# EAGLE design MyoWare_LED_Shield (EAGLE 7.5.0)
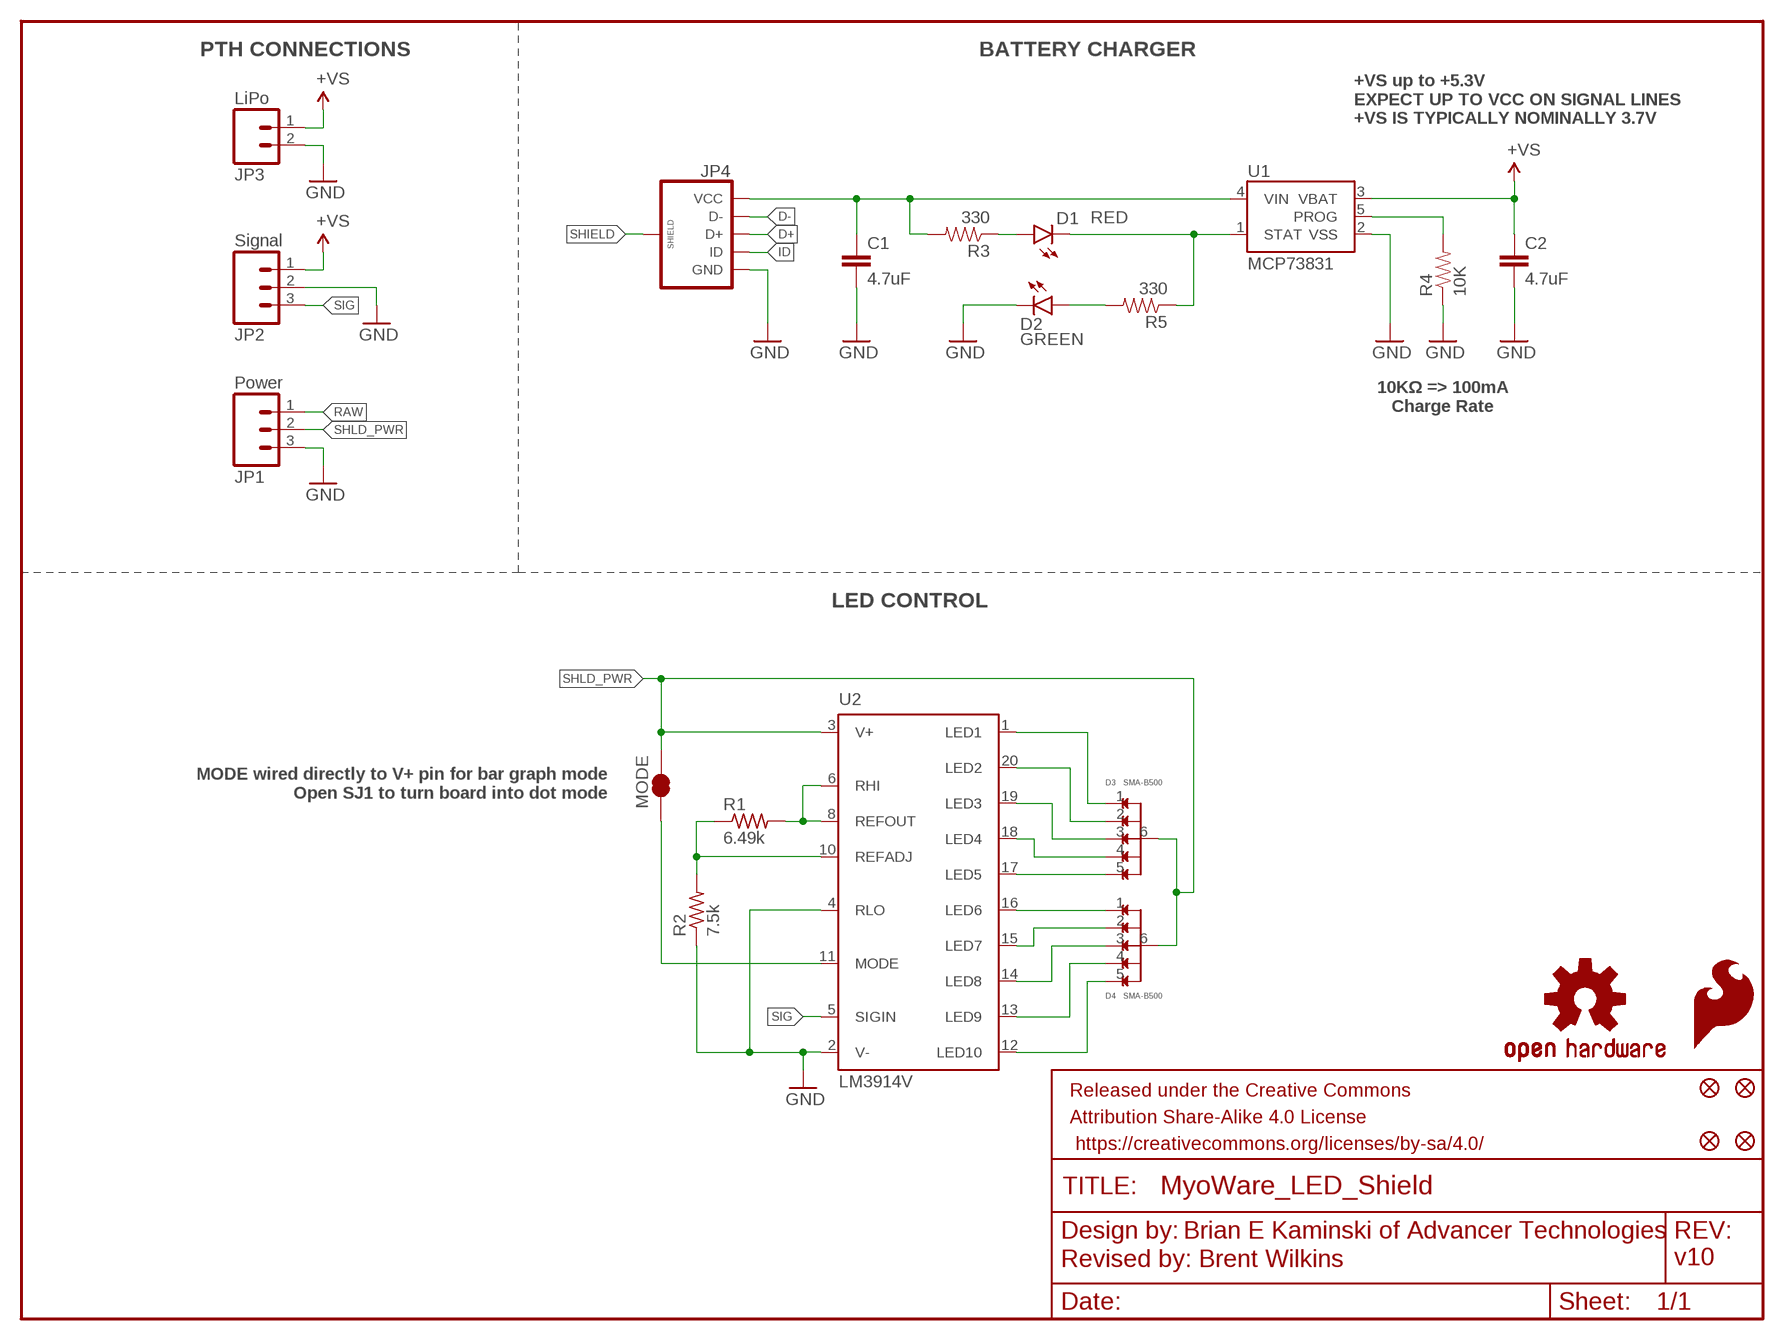
[diagram p0: schematic, sheet 1]

## Parts
C1  4.7uF  4.7UF-6.3V-10%(0603)0603  [0603-CAP]
C2  4.7uF  4.7UF-6.3V-10%(0603)0603  [0603-CAP]
D1  RED  LED-RED0603  [LED-0603]
D2  GREEN  LED-GREEN0603  [LED-0603]
D3  SMA-B500  [LED_BAR_SMD]
D4  SMA-B500  [LED_BAR_SMD]
FID1  FIDUCIAL1X2  [FIDUCIAL-1X2]
FID2  FIDUCIAL1X2  [FIDUCIAL-1X2]
FID3  FIDUCIAL1X2  [FIDUCIAL-1X2]
FID4  FIDUCIAL1X2  [FIDUCIAL-1X2]
FRAME1  FRAME-LETTER  [CREATIVE_COMMONS]
JP1  Power  M031X03_NO_SILK  [1X03_NO_SILK]
JP2  Signal  M031X03_NO_SILK  [1X03_NO_SILK]
JP3  LiPo  M021X02_NO_SILK  [1X02_NO_SILK]
JP4  USB_MICROB_PLUGCONN-11752  [USB-B-MICRO-SMD_V03]
LOGO1  SFE_LOGO_FLAME.1_INCH  [SFE_LOGO_FLAME_.1]
LOGO2  OSHW-LOGOS  [OSHW-LOGO-S]
MODE  JUMPER-PAD-2-NC_BY_TRACE  [PAD-JUMPER-2-NC_BY_TRACE_YES_SILK]
R1  6.49k  R-US_R0603  [R0603]
R2  7.5k  R-US_R0603  [R0603]
R3  330  330OHM1/10W1%(0603)  [0603-RES]
R4  10K  10KOHM-1/10W-1%(0603)0603  [0603-RES]
R5  330  330OHM1/10W1%(0603)  [0603-RES]
U1  MCP73831  [SOT23-5]
U2  LM3914V  [PLCC20S]

## Nets
+VS: C2.1 JP2.1 JP3.1 U1.3(VBAT)
D+: JP4.D+
D-: JP4.D-
GND: C1.2 C2.2 D2.C JP1.3 JP2.2 JP3.2 JP4.GND R2.1 R4.1 U1.2(VSS) U2.2(V-) U2.4(RLO)
ID: JP4.ID
N$1: D3.1 U2.1(LED1)
N$2: D3.2 U2.20(LED2)
N$3: D3.5 U2.17(LED5)
N$4: D3.3 U2.19(LED3)
N$5: D4.1 U2.16(LED6)
N$6: MODE.1 U2.11(MODE)
N$8: D3.4 U2.18(LED4)
N$9: D2.A R5.2
N$10: D1.A R3.1
N$11: D4.2 U2.15(LED7)
N$12: D4.3 U2.14(LED8)
N$13: D4.4 U2.13(LED9)
N$14: D4.5 U2.12(LED10)
N$15: D1.C R5.1 U1.1(STAT)
N$17: R4.2 U1.5(PROG)
N$19: R1.1 R2.2 U2.10(REFADJ)
N$20: R1.2 U2.6(RHI) U2.8(REFOUT)
RAW: JP1.1
SHIELD: JP4.SHIELD1(SHIELD) JP4.SHIELD2(SHIELD) JP4.SHIELD3(SHIELD)
SHLD_PWR: D3.6 D4.6 JP1.2 MODE.2 U2.3(V+)
SIG: JP2.3 U2.5(SIGIN)
VBUS: C1.1 JP4.VBUS(VCC) R3.2 U1.4(VIN)

## Notes on the sheet
- PTH CONNECTIONS | BATTERY CHARGER
- +VS up to +5.3V
  EXPECT UP TO VCC ON SIGNAL LINES
  +VS IS TYPICALLY NOMINALLY 3.7V
- 10KΩ => 100mA
  Charge Rate
- LED CONTROL
- MODE wired directly to V+ pin for bar graph mode
  Open SJ1 to turn board into dot mode
- Brian E Kaminski of Advancer Technologies
- Revised by: Brent Wilkins | v10

## Library data of the parts
C1 C2 = SparkFun-Capacitors:4.7UF-6.3V-10%(0603): CAP-08280; PROD_ID: CAP-08280
D1 = SparkFun-LED:LED-RED: Assorted Red LEDs LilyPad 1206- DIO-09912 1206- DIO-00809 0603- DIO-00819 "SMART" means more efficient and expensive; PROD_ID: DIO-00819
D2 = SparkFun-LED:LED-GREEN: Various green LEDs Green LEDs used in SFE Production 0603- DIO-00821 LARGE- DIO-00862 LILYPAD- DIO-09910; PROD_ID: DIO-00821
D3 D4 = Testing:SMA-B500; PROD_ID: DIO-13127
FID1-FID4 = SparkFun-Aesthetics:FIDUCIAL: Fiducial Alignment Points Various fiducial points for machine vision alignment.
FRAME1 = SparkFun-Aesthetics:FRAME-LETTER: Schematic Frame Standard 8.5x11 US Letter frame
JP1 JP2 = SparkFun-Connectors:M03: Header 3 Standard 3-pin 0.1" header. Use with straight break away headers (SKU : PRT-00116), right angle break away headers (PRT-00553), swiss pins (PRT-00743), machine pins (PRT-00117), and female headers (PRT-00115). Molex polarized connector foot print use with SKU : PRT-08232 with associated crimp pins and housings.
JP3 = SparkFun-Connectors:M02: Standard 2-pin 0.1" header. Use with - straight break away headers ( PRT-00116) - right angle break away headers (PRT-00553) - swiss pins (PRT-00743) - machine pins (PRT-00117) - female headers (PRT-00115) Molex polarized connector foot print use with: PRT-08233 with associated crimp pins and housings. 2.54_SCREWTERM for use with PRT-10571. 3.5mm Screw Terminal footprints for PRT-08084 5mm Screw Terminal footprints for use with PRT-08432
JP4 = SparkFun-Connectors:USB_MICROB_PLUG: USB Micro-B connectors Some male, some female. Watch your step!; PROD_ID: CONN-11752
LOGO1 = SparkFun-Aesthetics:SFE_LOGO_FLAME: SFE Logo, flame only This is the SparkFun flame logo. The logo on the schematic will always be the same size; the package variant is the height of the flame. Default layer for the logo on the board is tSilk.
LOGO2 = SparkFun-Aesthetics:OSHW-LOGO: Open Source Hardware Logo This logo indicates the piece of hardware it is found on incorporates a OSHW license and/or adheres to the definition of open source hardware found here: http://freedomdefined.org/OSHW
MODE = SparkFun-Passives:JUMPER-PAD-2-NC_BY_TRACE
R1 = resistor:R-US_: RESISTOR, American symbol; PROD_ID: RES-13202
R2 = resistor:R-US_: RESISTOR, American symbol; PROD_ID: RES-13203
R3 R5 = SparkFun-Resistors:330OHM1/10W1%(0603): RES-00818; PROD_ID: RES-00818
R4 = SparkFun-Resistors:10KOHM-1/10W-1%(0603): RES-00824; PROD_ID: RES-00824
U1 = SparkFun-PowerIC:MCP73831: Miniature single cell, fully integrated Li-Ion, Li-polymer charge management controller http://ww1.microchip.com/downloads/en/DeviceDoc/20001984g.pdf IC-09995; PROD_ID: IC-09995
U2 = Testing:LM391: Dot/Bar Display Driver Source: Data sheet LM3915 <http://www.national.com/ds/LM/LM3915.pdf> Data sheet LM3914 <http://www.national.com/ds/LM/LM3914.pdf>; PROD_ID: IC-13110

## Board
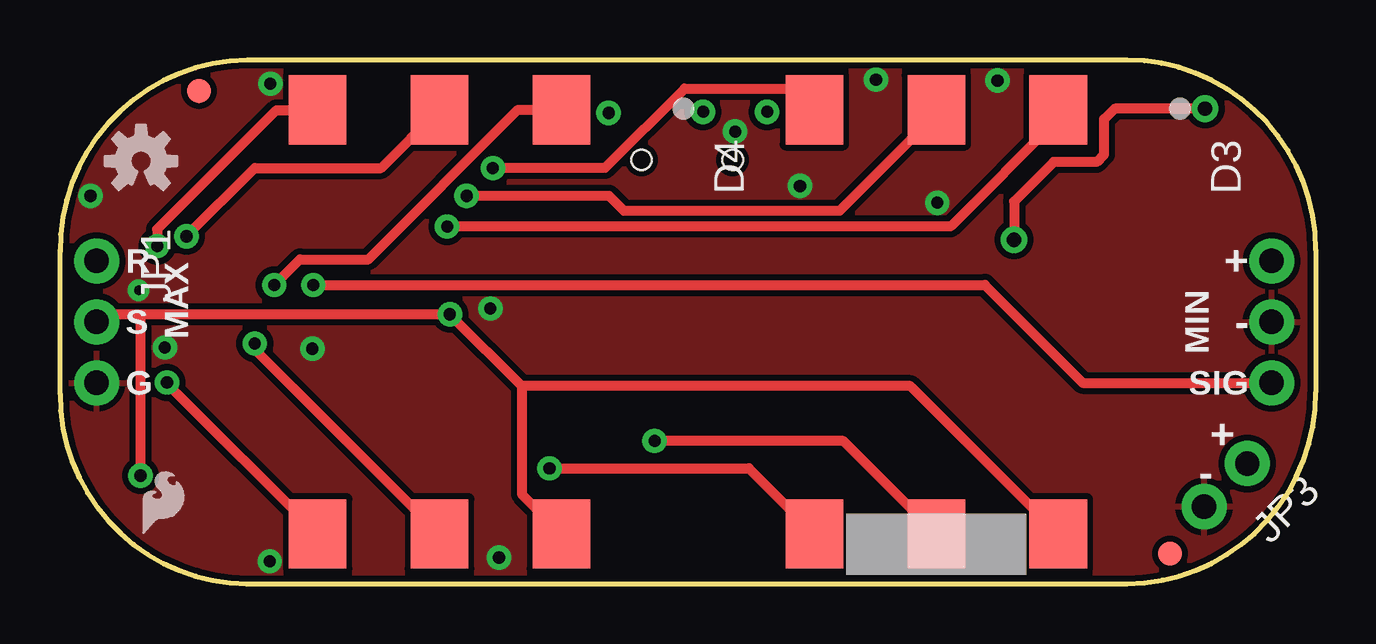
[diagram p1: board, top side]
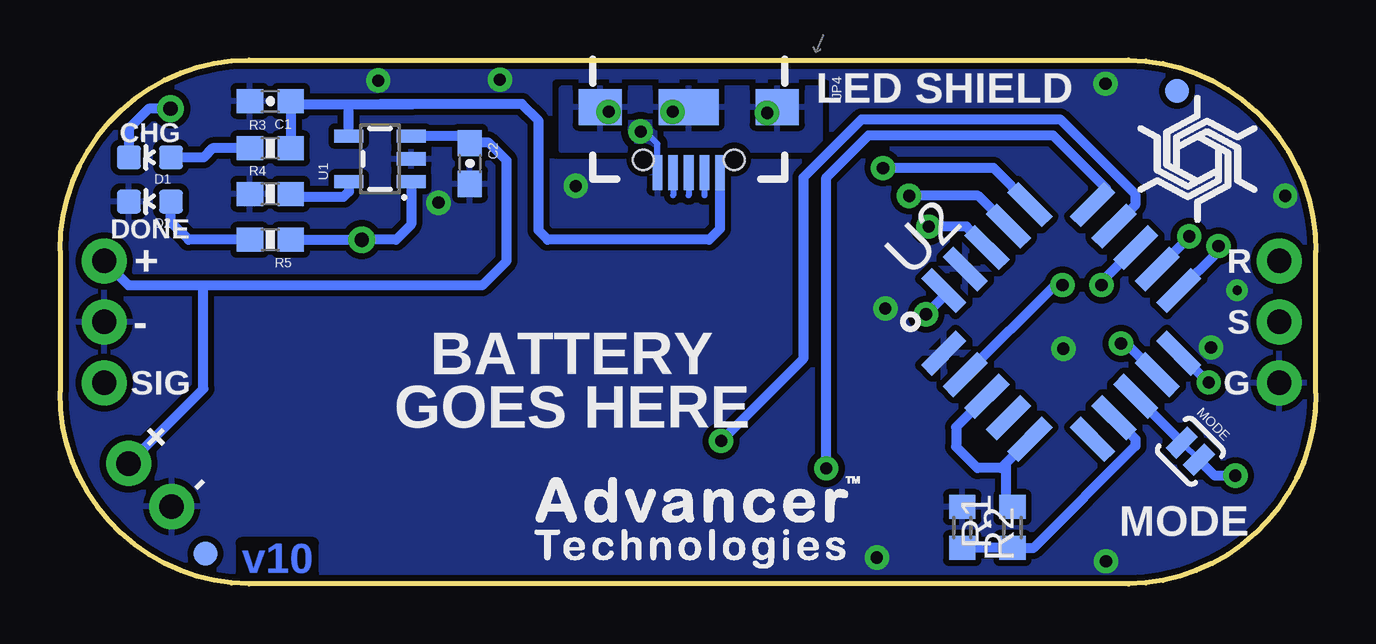
[diagram p2: board, bottom side, seen from below]

Size 52.32 x 21.84 mm. Coordinates in mm from the lower left corner, seen from the top.
Outline: 7.78,0 7.81,0
Outline: 7.81,0 44.45,0 arc90 52.32,8 52.32,13.91 arc90 44.45,21.84 7.81,21.84 arc90 0,13.84
Outline: 0,13.84 0,7.94 arc90 7.81,0
Outline: 0,13.84 0,13.91
Copper layers (1*16): Top 0.035mm / dielectric 1.5mm / Bottom 0.035mm
Design rules "SparkFun-2-layer-STANDARD": minimum track width 10mil, minimum drill 20mil, track to track 10mil, track to pad 8mil, pad to pad 8mil, via to via 10mil, smd to smd 8mil, copper to edge 8mil, drill to drill 8mil, minimum pad ring 10mil, minimum via ring 10mil, stop-mask expansion 4mil, vias tented up to drill 20mil, thermal gap 10mil

### Footprints (pad centres in the part's own frame; a part is rotated, then mirrored left to right if it is on the bottom)
0603-CAP = smd 1.1 x 1: 1 -0.85,0; 2 0.85,0
LED-0603 = smd 1 x 1: A 0,-0.877; C 0,0.877
LED_BAR_SMD = smd 2.4 x 2.88: 1 -5.08,-8.84; 2 0,-8.84; 3 5.08,-8.84; 4 5.08,8.84; 5 0,8.84; 6 -5.08,8.84
FIDUCIAL-1X2 = smd 1 x 1: 1 0,0
1X03_NO_SILK = drill 1.016 pad 1.88: 1 0,0; 2 2.54,0; 3 5.08,0
1X02_NO_SILK = drill 1.016 pad 1.88: 1 0,0; 2 2.54,0
USB-B-MICRO-SMD_V03 = smd 1.45 x 0.4: D+ 2.725,0; D- 2.725,0.65; GND 2.725,-1.3; ID 2.725,-0.65; VBUS 2.725,1.3 | smd 1.5 x 1.8: SHIELD1 0,3.685; SHIELD2 0,-3.685 | smd 1.5 x 2.5: SHIELD3 0,0 | hole 0.85: 2.2,1.9; 2.2,-1.9
PAD-JUMPER-2-NC_BY_TRACE_YES_SILK = smd 0.635 x 1.27: 1 -0.508,0; 2 0.508,0
R0603 = smd 1 x 1.1: 1 -0.85,0; 2 0.85,0
0603-RES = smd 1.1 x 1: 1 -0.85,0; 2 0.85,0
SOT23-5 = smd 0.55 x 1.2: 1 -0.95,-1.3; 2 0,-1.3; 3 0.95,-1.3; 4 0.95,1.3; 5 -0.95,1.3
PLCC20S = smd 0.63 x 2.035: 1 0,4.383; 2 -1.27,4.383; 3 -2.54,4.383; 9 -2.54,-4.383; 10 -1.27,-4.383; 11 0,-4.383; 12 1.27,-4.383; 13 2.54,-4.383; 19 2.54,4.383; 20 1.27,4.383 | smd 2.035 x 0.63: 4 -4.383,2.54; 5 -4.383,1.27; 6 -4.383,0; 7 -4.383,-1.27; 8 -4.383,-2.54; 14 4.383,-2.54; 15 4.383,-1.27; 16 4.383,0; 17 4.383,1.27; 18 4.383,2.54

### Placement (x,y rotation side)
C1  43.56,20.13 180 bottom
C2  35.24,17.53 270 bottom
D1  48.58,17.78 90 bottom
D2  48.58,15.94 90 bottom
D3  36.51,10.92 180 top
D4  15.81,10.92 180 top
FID1  5.79,20.55 0 bottom
FID2  46.25,1.27 0 bottom
FID3  46.25,1.27 0 top
FID4  5.79,20.55 0 top
FRAME1  -12.19,-15.49 0 top  (outside the outline)
JP1  1.52,13.46 270 top
JP2  50.48,13.46 270 top
JP3  49.47,5.02 225 top
JP4  26.13,19.88 270 bottom
LOGO1  3.15,1.75 0 top
LOGO2  3.38,17.63 0 top
MODE  5.23,5.53 315 bottom
R1  12.64,2.35 90 bottom
R2  14.73,2.35 270 bottom
R3  43.56,18.16 0 bottom
R4  43.56,16.26 0 bottom
R5  43.56,14.35 180 bottom
U1  38.99,17.72 90 bottom
U2  10.6,10.92 45 bottom
U$6  [ADVANCER_LOGO]  26.13,2.35 0 bottom
U$9  [SPIRAL_LOGO_60%]  4.89,17.72 0 bottom

### Tracks (layer width: path | path; a pad name or v marks a point on that pad's centre or on a via)
+VS
  Bottom 0.406: 35.24,18.41 35.24,18.67 U1.3 | 35.24,18.41 C2.1 | 46.35,12.45 34.73,12.45 33.72,13.46 33.72,17.65 34.48,18.41 35.24,18.41 | JP3.1 46.35,8.13 46.35,12.45 | 46.35,12.45 49.47,12.45 JP2.1
D+
  Bottom 0.254: JP4.D+ 26.13,16.19
D-
  Bottom 0.254: JP4.D- 25.48,16.19
GND  (via drill 0.38, 0.51)
  Bottom 0.254: 27.75,18.67 27.43,18.35 27.43,17.45 JP4.GND
  other vias: 1.27,16.18 30.84,16.59 18.29,1.09 10.52,9.8 4.37,9.86 3.28,12.24 8.74,0.94 17.93,11.48 8.76,20.85 34,21.02 39.06,20.98 36.55,15.89 28.13,18.86
  pour Bottom (isolate 0.254, rank 3): 0,0 52.32,0 52.32,21.84 0,21.84
  pour Top (isolate 0.254): 0,21.84 52.32,21.84 52.32,0 0,0
ID
  Bottom 0.254: JP4.ID 26.78,16.19
N$1  (via drill 0.51)
  Top 0.406: v16.13,14.9 37.11,14.9 41.58,19.37 41.58,19.75 D3.1
  Bottom 0.406: v16.13,14.9 14.55,14.9 13.7,14.05 U2.1
N$2  (via drill 0.51)
  Top 0.406: v16.94,16.18 22.87,16.18 23.5,15.56 32.49,15.56 36.3,19.37 36.3,19.55 D3.2
  Bottom 0.406: U2.20 14.07,16.18 v16.94,16.18
N$3  (via drill 0.51)
  Top 0.406: v24.78,5.96 32.64,5.96 D3.5
  Bottom 0.406: v24.78,5.96 21.34,9.4 21.34,16.95 18.92,19.37 10.65,19.37 7.53,16.25 7.53,15.79 U2.17
N$4  (via drill 0.51)
  Top 0.406: v18.03,17.34 22.71,17.34 26.02,20.65 30.63,20.65 31.43,19.85 D3.3 31.23,19.96
  Bottom 0.406: U2.19 13.43,17.34 v18.03,17.34
N$5  (via drill 0.51)
  Top 0.406: v8.93,12.46 9.99,13.53 12.84,13.53 19.08,19.76 D4.1
  Bottom 0.406: U2.16 8.93,12.6 v8.93,12.46
N$6
  Bottom 0.406: U2.11 MODE.1
N$8  (via drill 0.51)
  Top 0.406: v20.4,4.81 28.7,4.81 D3.4
  Bottom 0.406: 8.83,16.45 8.83,16.29 U2.18 9.3,15.92 8.74,16.48 10.95,18.69 18.64,18.69 20.4,16.94 v20.4,4.81
N$9
  Bottom 0.406: R5.2 46.97,14.35 47.7,15.09 D2.A
N$10
  Bottom 0.406: R3.1 45.96,18.16 46.34,17.78 D1.A
N$11  (via drill 0.51)
  Top 0.406: D4.2 13.38,17.34 8.12,17.34 v5.27,14.49
  Bottom 0.406: U2.15 5.27,14.46 v5.27,14.49
N$12  (via drill 0.51)
  Top 0.406: D4.3 10.72,19.75 9.02,19.75 4.05,14.78 v4.05,14.08
  Bottom 0.406: U2.14 4.05,13.88 v4.05,14.08
N$13  (via drill 0.51)
  Top 0.406: v4.46,8.39 4.46,8.36 D4.4
  Bottom 0.406: U2.13 4.49,8.39 v4.46,8.39
N$14  (via drill 0.51)
  Top 0.406: v8.12,10.02 8.12,9.78 D4.5
  Bottom 0.406: U2.12 7.91,10.02 v8.12,10.02
N$15  (via drill 0.6)
  Top 0.406: v47.72,19.81 43.94,19.81 43.51,19.38 43.51,17.91 43.19,17.59 41.4,17.59 39.75,15.94 v39.75,14.35
  Bottom 0.406: U1.1 37.69,14.99 38.32,14.35 v39.75,14.35 R5.1 | v47.72,19.81 48.63,19.81 49.45,18.99 D1.C
N$17
  Bottom 0.406: U1.5 40.29,16.35 40.51,16.13 42.58,16.13 R4.2
N$19
  Bottom 0.406: R2.2 R1.1 12.62,1.49 11.77,1.49 7.52,5.74 7.52,6.04 U2.10
N$20
  Bottom 0.406: R1.2 12.89,3.2 12.89,5.04 U2.8 13.11,4.83 14.1,4.83 14.99,5.71 14.99,6.54 U2.6
SHIELD  (via drill 0.51)
  Bottom 0.254: JP4.SHIELD3 26.13,19.68 v26.8,19.68 | v29.46,19.68 29.46,19.88 JP4.SHIELD2
  other vias: 22.86,19.64
  pour Bottom (isolate 0.305): 20.64,20.64 31.43,20.64 31.43,18.1 20.64,18.1
SHLD_PWR  (via drill 0.51)
  Top 0.406: 3.35,11.24 v16.24,11.24 19.24,8.24 | 3.35,11.24 1.75,11.24 1.75,11.15 JP1.2 | 3.35,11.24 v3.35,4.51 | 19.24,8.24 35.43,8.24 D3.6 | 19.24,8.24 19.24,3.73 D4.6
  Bottom 0.406: v16.24,11.24 15.43,12.05 15.43,12.16 U2.3 | v3.35,4.51 4.2,4.51 MODE.2
SIG  (via drill 0.51)
  Top 0.406: v10.55,12.46 38.53,12.46 42.61,8.38 JP2.3
  Bottom 0.406: U2.5 10.86,12.46 v10.55,12.46
VBUS
  Bottom 0.406: 42.71,20 R3.2 | 42.71,20 C1.1 | JP4.VBUS 24.83,14.8 25.27,14.35 32,14.35 32.38,14.73 32.38,19.3 33.08,20 37.66,20 | 37.66,20 38.95,20 | 42.71,20 40.32,20 | 40.32,20 37.66,20 | U1.4 40.29,19.97 40.32,20

### Text on the board
Bottom: v10
tPlace: R | + | MAX | S | MIN | - | G | SIG | + | -
bPlace: LED SHIELD | CHG | DONE | R | R | + | S | - | BATTERY / GOES HERE | G | SIG | + | - | MODE
Measures: ALL UNITS IN INCHES
tDocu: External cable connector lines up here => | Brian E Kaminski of Advancer Technologies | Revised by: Brent Wilkins